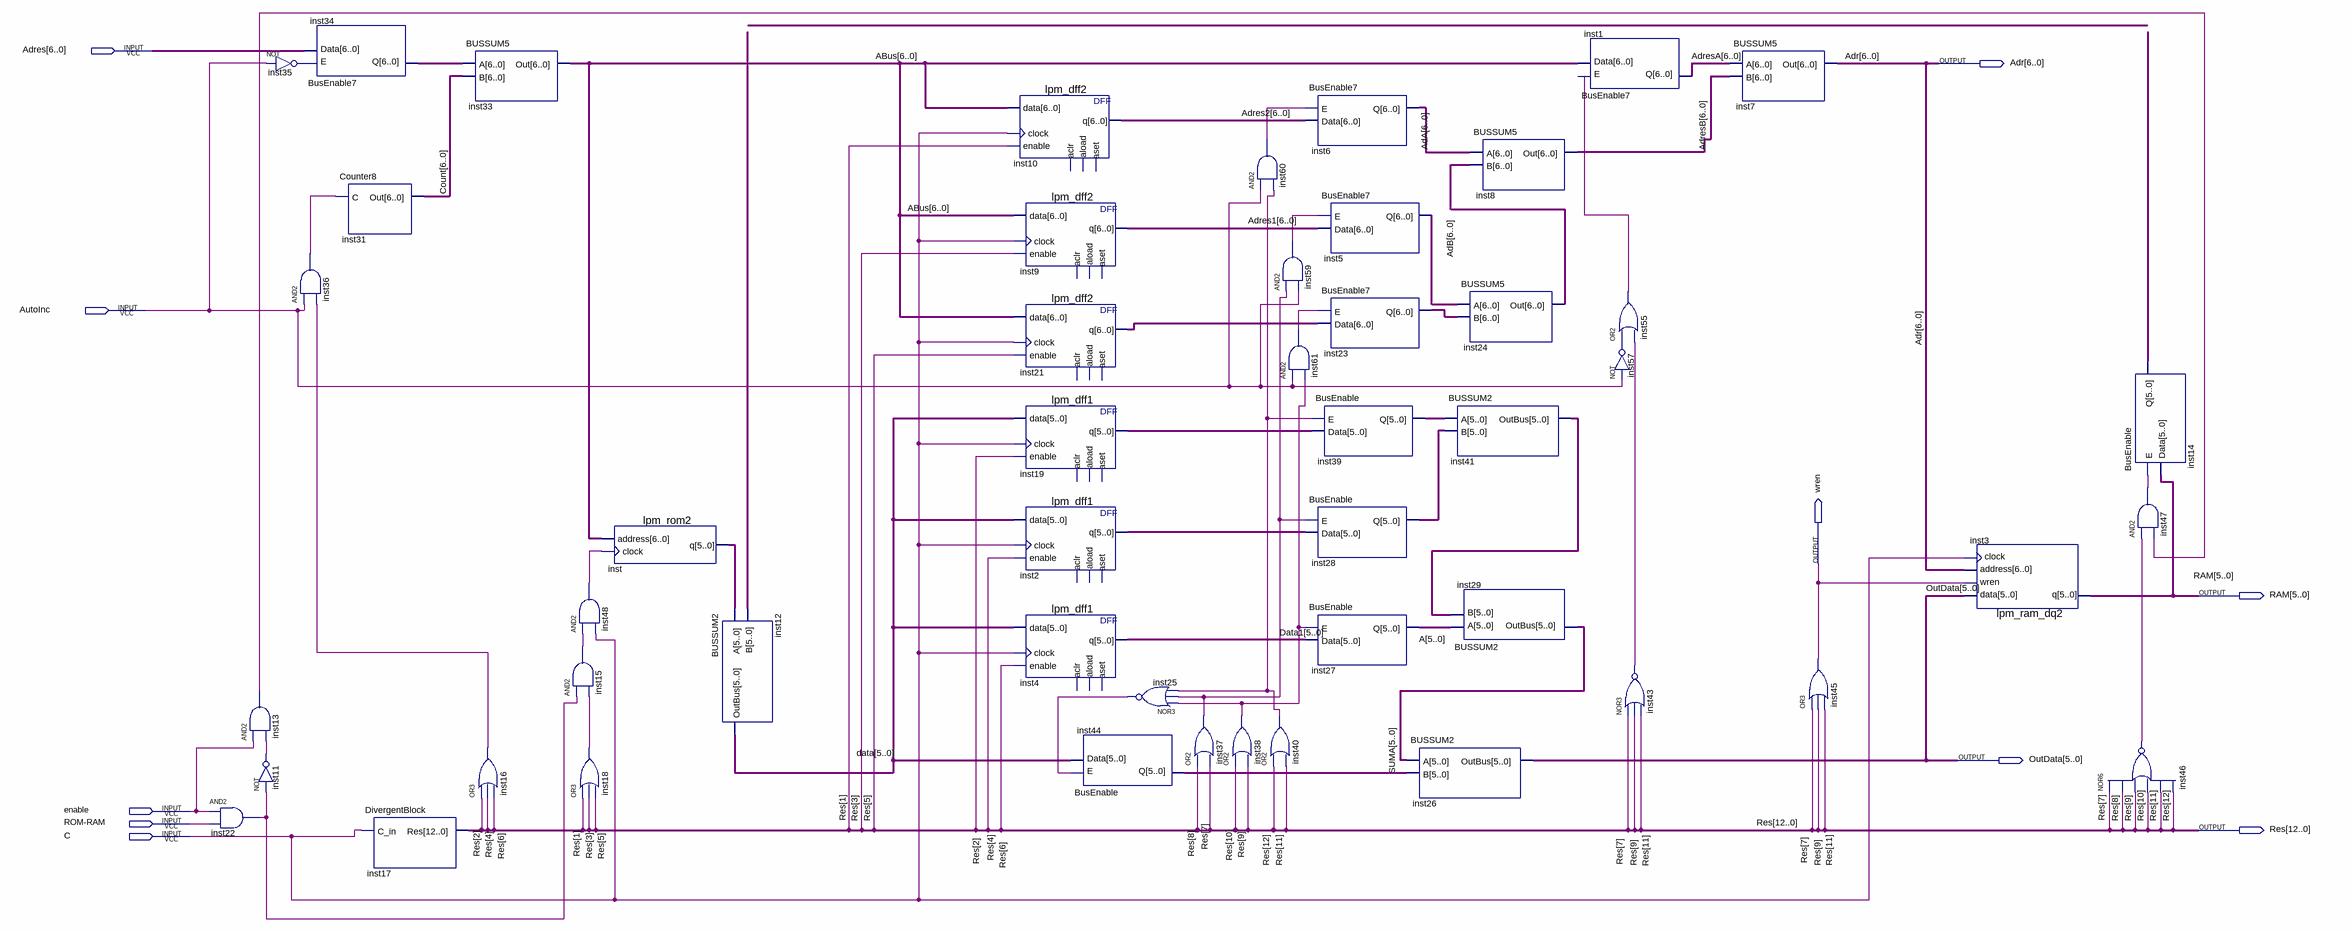
[diagram p0: schematic sheet]
// Quartus schematic L3.bdf as structural Verilog: 50 symbols, 10 pins
module L3 (
  input  [6:0] Adres,
  input  AutoInc,
  input  enable,
  input  \ROM-RAM ,
  input  C,
  output [6:0] Adr,
  output wren,
  output [5:0] RAM,
  output [5:0] OutData,
  output [12:0] Res
);

  wire inst11_out, inst13_out, inst15_out, inst16_out, inst18_out, inst22_out, inst25_out, inst35_out,
       inst36_out, inst37_out, inst38_out, inst40_out, inst43_out, inst46_out, inst47_out, inst48_out,
       inst55_out, inst57_out, inst59_out, inst60_out, inst61_out;
  wire [5:0] A, data, Data1, inst2_q, inst14_q, inst19_q, inst28_q, inst39_q, inst41_outbus, inst44_q,
       inst_q, SUMA, undriven;
  wire [6:0] ABus, AdA, AdB, Adres1, Adres2, AdresA, AdresB, Count, inst21_q, inst23_q, inst24_out, inst34_q;

  and inst22 (inst22_out, enable, \ROM-RAM );
  not inst35 (inst35_out, AutoInc);
  and inst13 (inst13_out, enable, inst11_out);
  not inst11 (inst11_out, inst22_out);
  BusEnable7 inst34 (.E(inst35_out), .Data(Adres), .Q(inst34_q));
  and inst36 (inst36_out, AutoInc, inst16_out);
  Counter8 inst31 (.C(inst36_out), .Out(Count));
  DivergentBlock inst17 (.C_in(C), .Res(Res));
  BUSSUM5 inst33 (.A(inst34_q), .B(Count), .Out(ABus));
  or inst16 (inst16_out, Res[2], Res[4], Res[6]);
  and inst48 (inst48_out, inst15_out, C);
  and inst15 (inst15_out, inst22_out, inst18_out);
  or inst18 (inst18_out, Res[1], Res[3], Res[5]);
  lpm_rom2 inst (.address(ABus), .clock(inst48_out), .q(inst_q));
  BUSSUM2 inst12 (.A(inst_q), .B(undriven), .OutBus(data));
  lpm_dff2 inst10 (.data(ABus), .clock(C), .enable(Res[1]), .q(Adres2));  // open: aclr, aload, aset
  lpm_dff2 inst9 (.data(ABus), .clock(C), .enable(Res[3]), .q(Adres1));  // open: aclr, aload, aset
  lpm_dff2 inst21 (.data(ABus), .clock(C), .enable(Res[5]), .q(inst21_q));  // open: aclr, aload, aset
  lpm_dff1 inst19 (.data(data), .clock(C), .enable(Res[2]), .q(inst19_q));  // open: aclr, aload, aset
  lpm_dff1 inst2 (.data(data), .clock(C), .enable(Res[4]), .q(inst2_q));  // open: aclr, aload, aset
  lpm_dff1 inst4 (.data(data), .clock(C), .enable(Res[6]), .q(Data1));  // open: aclr, aload, aset
  BusEnable inst44 (.E(inst25_out), .Data(data), .Q(inst44_q));
  nor inst25 (inst25_out, inst38_out, inst37_out, inst40_out);
  or inst37 (inst37_out, Res[8], Res[7]);
  or inst38 (inst38_out, Res[10], Res[9]);
  and inst60 (inst60_out, AutoInc, inst40_out);
  and inst59 (inst59_out, inst37_out, AutoInc);
  and inst61 (inst61_out, AutoInc, inst38_out);
  or inst40 (inst40_out, Res[12], Res[11]);
  BusEnable7 inst6 (.E(inst60_out), .Data(Adres2), .Q(AdA));
  BusEnable7 inst5 (.E(inst59_out), .Data(Adres1), .Q(AdB));
  BusEnable7 inst23 (.E(inst61_out), .Data(inst21_q), .Q(inst23_q));
  BusEnable inst39 (.E(inst40_out), .Data(inst19_q), .Q(inst39_q));
  BusEnable inst28 (.E(inst37_out), .Data(inst2_q), .Q(inst28_q));
  BusEnable inst27 (.E(inst38_out), .Data(Data1), .Q(A));
  BUSSUM2 inst26 (.A(SUMA), .B(inst44_q), .OutBus(OutData));
  BUSSUM5 inst8 (.A(AdA), .B(inst24_out), .Out(AdresB));
  BUSSUM5 inst24 (.A(AdB), .B(inst23_q), .Out(inst24_out));
  BUSSUM2 inst41 (.A(inst39_q), .B(inst28_q), .OutBus(inst41_outbus));
  BUSSUM2 inst29 (.A(A), .B(inst41_outbus), .OutBus(SUMA));
  BusEnable7 inst1 (.E(inst55_out), .Data(ABus), .Q(AdresA));
  or inst55 (inst55_out, inst57_out, inst43_out);
  not inst57 (inst57_out, AutoInc);
  nor inst43 (inst43_out, Res[7], Res[9], Res[11]);
  BUSSUM5 inst7 (.A(AdresA), .B(AdresB), .Out(Adr));
  or inst45 (wren, Res[7], Res[9], Res[11]);
  lpm_ram_dq2 inst3 (.data(OutData), .wren(wren), .address(Adr), .clock(C), .q(RAM));
  BusEnable inst14 (.E(inst47_out), .Data(RAM), .Q(inst14_q));
  and inst47 (inst47_out, inst46_out, inst13_out);
  nor inst46 (inst46_out, Res[7], Res[8], Res[9], Res[10], Res[11], Res[12]);
endmodule
